# Altium project GARY_backplane.PrjPcb
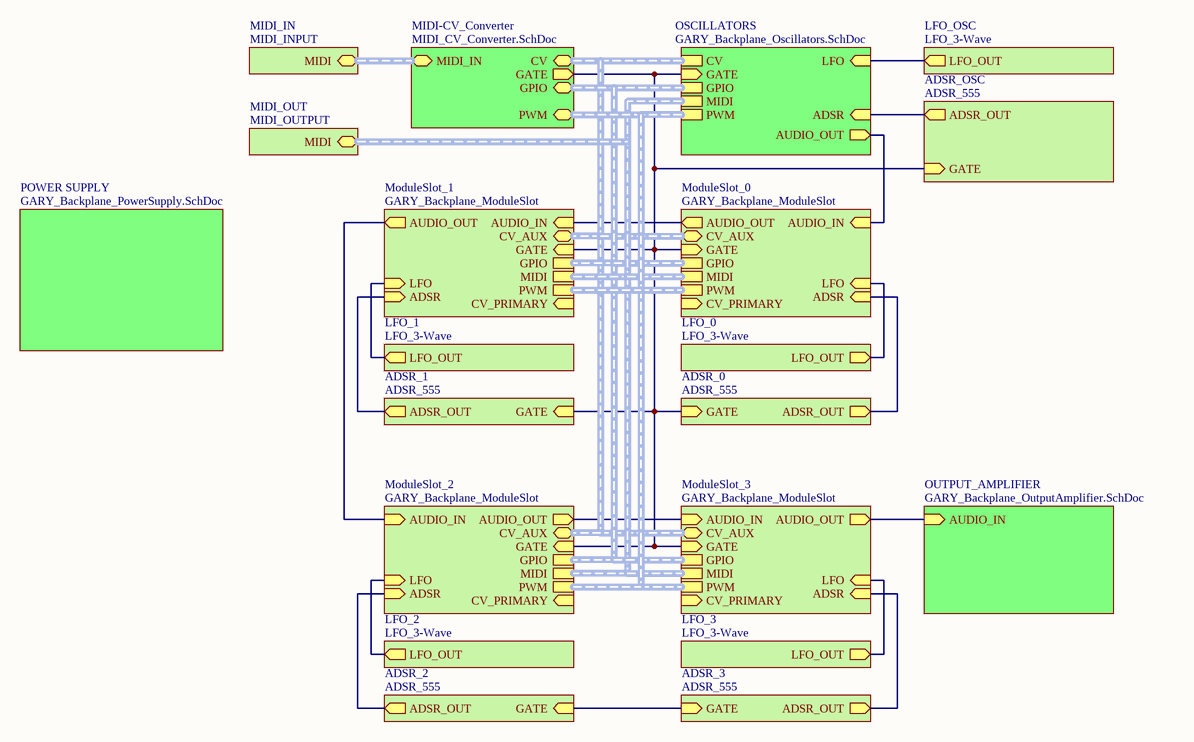
[diagram p0: backplane.SchDoc]
6 sheets, 8 parts. Net scope: hierarchical (ports join the sheet entries above them; power ports are global).
Board file: backplane.PcbDoc
Sheets:
  backplane.SchDoc
    MIDI-CV_Converter = MIDI_CV_Converter.SchDoc
    OSCILLATORS = GARY_Backplane_Oscillators.SchDoc
      SUMMING_AMPLIFIER = GARY_Backplane_OscillatorSummingAmplifier.SchDoc
    OUTPUT_AMPLIFIER = GARY_Backplane_OutputAmplifier.SchDoc
    POWER SUPPLY = GARY_Backplane_PowerSupply.SchDoc

## Sheet backplane.SchDoc: Backplane: Interconnect Diagram
size Letter; Engineer: Nicholas Morrow; DocumentNumber: 3; SheetNumber: 3; SheetTotal: 11; Project: GARY Synthesizer; ProjectName: GARY Synthesizer

### Sub-sheets
ADSR_0 = ADSR_555 (file not in this document): GATE (in), ADSR_OUT (out)
ADSR_1 = ADSR_555 (file not in this document): GATE (in), ADSR_OUT (out)
ADSR_2 = ADSR_555 (file not in this document): GATE (in), ADSR_OUT (out)
ADSR_3 = ADSR_555 (file not in this document): GATE (in), ADSR_OUT (out)
ADSR_OSC = ADSR_555 (file not in this document): GATE (in), ADSR_OUT (out)
LFO_0 = LFO_3-Wave (file not in this document): LFO_OUT (out)
LFO_1 = LFO_3-Wave (file not in this document): LFO_OUT (out)
LFO_2 = LFO_3-Wave (file not in this document): LFO_OUT (out)
LFO_3 = LFO_3-Wave (file not in this document): LFO_OUT (out)
LFO_OSC = LFO_3-Wave (file not in this document): LFO_OUT (out)
MIDI-CV_Converter = MIDI_CV_Converter.SchDoc: PWM (harness PWM), GPIO (harness GPIO), GATE (out), CV (harness CV_8_VOICE), MIDI_IN (harness MIDI)
MIDI_IN = MIDI_INPUT (file not in this document): MIDI (harness MIDI)
MIDI_OUT = MIDI_OUTPUT (file not in this document): MIDI (harness MIDI)
ModuleSlot_0 = GARY_Backplane_ModuleSlot (file not in this document): GPIO (harness GPIO), MIDI (harness MIDI), PWM (harness PWM), CV_AUX (harness CV_8_VOICE), GATE (in), AUDIO_IN (in), LFO (in), ADSR (in), AUDIO_OUT (out), CV_PRIMARY (in)
ModuleSlot_1 = GARY_Backplane_ModuleSlot (file not in this document): GPIO (harness GPIO), MIDI (harness MIDI), PWM (harness PWM), CV_AUX (harness CV_8_VOICE), GATE (in), AUDIO_IN (in), LFO (in), ADSR (in), AUDIO_OUT (out), CV_PRIMARY (in)
ModuleSlot_2 = GARY_Backplane_ModuleSlot (file not in this document): GPIO (harness GPIO), MIDI (harness MIDI), PWM (harness PWM), CV_AUX (harness CV_8_VOICE), GATE (in), AUDIO_IN (in), LFO (in), ADSR (in), AUDIO_OUT (out), CV_PRIMARY (in)
ModuleSlot_3 = GARY_Backplane_ModuleSlot (file not in this document): GPIO (harness GPIO), MIDI (harness MIDI), PWM (harness PWM), CV_AUX (harness CV_8_VOICE), GATE (in), AUDIO_IN (in), LFO (in), ADSR (in), AUDIO_OUT (out), CV_PRIMARY (in)
OSCILLATORS = GARY_Backplane_Oscillators.SchDoc: CV (harness CV_8_VOICE), GPIO (harness GPIO), GATE (in), MIDI (harness MIDI), PWM (harness PWM), AUDIO_OUT (out), LFO (in), ADSR (in)
OUTPUT_AMPLIFIER = GARY_Backplane_OutputAmplifier.SchDoc: AUDIO_IN (in)
POWER SUPPLY = GARY_Backplane_PowerSupply.SchDoc: no entries

### Nets
NetMCVC_CON_5: sheet ModuleSlot_0/GATE, sheet MIDI-CV_Converter/GATE, sheet ADSR_0/GATE, sheet OSCILLATORS/GATE, sheet ADSR_OSC/GATE, sheet ADSR_1/GATE, sheet ModuleSlot_1/GATE, sheet ModuleSlot_2/GATE, sheet ModuleSlot_3/GATE
(unnamed): sheet LFO_0/LFO_OUT, sheet ModuleSlot_0/LFO
(unnamed): sheet ModuleSlot_0/AUDIO_IN, sheet OSCILLATORS/AUDIO_OUT
(unnamed): sheet ModuleSlot_0/ADSR, sheet ADSR_0/ADSR_OUT
(unnamed): sheet ModuleSlot_0/AUDIO_OUT, sheet ModuleSlot_1/AUDIO_IN
(unnamed): sheet OSCILLATORS/LFO, sheet LFO_OSC/LFO_OUT
(unnamed): sheet OSCILLATORS/ADSR, sheet ADSR_OSC/ADSR_OUT
(unnamed): sheet OUTPUT_AMPLIFIER/AUDIO_IN, sheet ModuleSlot_3/AUDIO_OUT
(unnamed): sheet LFO_1/LFO_OUT, sheet ModuleSlot_1/LFO
(unnamed): sheet ADSR_1/ADSR_OUT, sheet ModuleSlot_1/ADSR
(unnamed): sheet LFO_2/LFO_OUT, sheet ModuleSlot_2/LFO
(unnamed): sheet ADSR_2/GATE, sheet ADSR_3/GATE
(unnamed): sheet ADSR_2/ADSR_OUT, sheet ModuleSlot_2/ADSR
(unnamed): sheet LFO_3/LFO_OUT, sheet ModuleSlot_3/LFO
(unnamed): sheet ADSR_3/ADSR_OUT, sheet ModuleSlot_3/ADSR
(unnamed): sheet ModuleSlot_1/AUDIO_OUT, sheet ModuleSlot_2/AUDIO_IN
(unnamed): sheet ModuleSlot_2/AUDIO_OUT, sheet ModuleSlot_3/AUDIO_IN

### Buses and harness runs
harness sheet MIDI-CV_Converter/CV = sheet ModuleSlot_0/CV_AUX = sheet ModuleSlot_1/CV_AUX = sheet ModuleSlot_2/CV_AUX = sheet ModuleSlot_3/CV_AUX = sheet OSCILLATORS/CV
harness sheet MIDI-CV_Converter/GPIO = sheet ModuleSlot_0/GPIO = sheet ModuleSlot_1/GPIO = sheet ModuleSlot_2/GPIO = sheet ModuleSlot_3/GPIO = sheet OSCILLATORS/GPIO
harness sheet MIDI-CV_Converter/MIDI_IN = sheet MIDI_IN/MIDI
harness sheet MIDI-CV_Converter/PWM = sheet ModuleSlot_0/PWM = sheet ModuleSlot_1/PWM = sheet ModuleSlot_2/PWM = sheet ModuleSlot_3/PWM = sheet OSCILLATORS/PWM
harness sheet MIDI_OUT/MIDI = sheet ModuleSlot_0/MIDI = sheet ModuleSlot_1/MIDI = sheet ModuleSlot_2/MIDI = sheet ModuleSlot_3/MIDI = sheet OSCILLATORS/MIDI

### Notes on the sheet
- Notes:
- Title:
- Size:
- Project:
- Letter
- Number:
- Revision:
- Date:
- Engineer:
- Sheet:
- of

## Sheet MIDI_CV_Converter.SchDoc: Backplane: MIDI-CV Converter Connector
size Letter; Engineer: Nicholas Morrow; Project: GARY Synthesizer
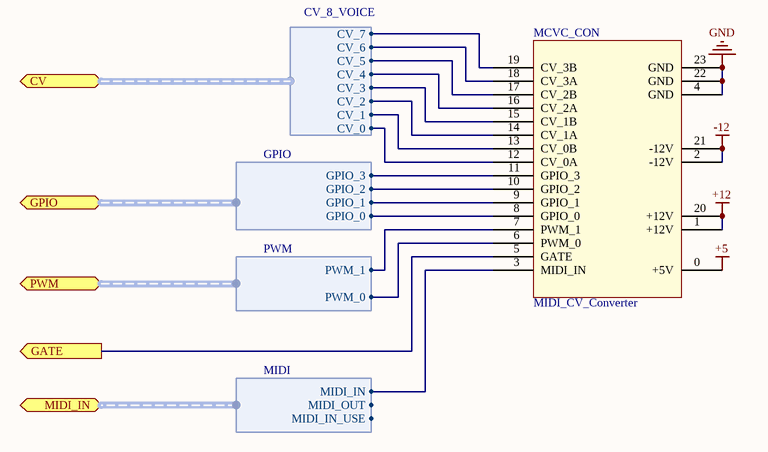
[diagram p1: MIDI_CV_Converter.SchDoc]

### Parts
MCVC_CON  MIDI_CV_Converter  [MIDI-CV CONVERTER SOCKET]

### Ports
CV (harness CV_8_VOICE), GATE (out), GPIO (harness GPIO), MIDI_IN (harness MIDI), PWM (harness PWM)

### Harnesses
CV_8_VOICE: CV_0, CV_2, CV_4, CV_6, CV_1, CV_3, CV_5, CV_7
MIDI: MIDI_IN, MIDI_OUT, MIDI_IN_USE
GPIO: GPIO_0, GPIO_1, GPIO_2, GPIO_3
PWM: PWM_0, PWM_1

### Nets
+5: MCVC_CON.0(+5V)  [project net +5V]
+12: MCVC_CON.1(+12V) MCVC_CON.20(+12V)  [project net +12V]
-12: MCVC_CON.2(-12V) MCVC_CON.21(-12V)  [project net -12V]
GND: MCVC_CON.4(GND) MCVC_CON.22(GND) MCVC_CON.23(GND)
NetMCVC_CON_3: MCVC_CON.3(MIDI_IN) ; port MIDI_IN.MIDI_IN
NetMCVC_CON_5: MCVC_CON.5(GATE) ; port GATE
NetMCVC_CON_6: MCVC_CON.6(PWM_0) ; port PWM.PWM_0
NetMCVC_CON_7: MCVC_CON.7(PWM_1) ; port PWM.PWM_1
NetMCVC_CON_8: MCVC_CON.8(GPIO_0) ; port GPIO.GPIO_0
NetMCVC_CON_9: MCVC_CON.9(GPIO_1) ; port GPIO.GPIO_1
NetMCVC_CON_10: MCVC_CON.10(GPIO_2) ; port GPIO.GPIO_2
NetMCVC_CON_11: MCVC_CON.11(GPIO_3) ; port GPIO.GPIO_3
NetMCVC_CON_12: MCVC_CON.12(CV_0A) ; port CV.CV_0
NetMCVC_CON_13: MCVC_CON.13(CV_0B) ; port CV.CV_1
NetMCVC_CON_14: MCVC_CON.14(CV_1A) ; port CV.CV_2
NetMCVC_CON_15: MCVC_CON.15(CV_1B) ; port CV.CV_3
NetMCVC_CON_16: MCVC_CON.16(CV_2A) ; port CV.CV_4
NetMCVC_CON_17: MCVC_CON.17(CV_2B) ; port CV.CV_5
NetMCVC_CON_18: MCVC_CON.18(CV_3A) ; port CV.CV_6
NetMCVC_CON_19: MCVC_CON.19(CV_3B) ; port CV.CV_7

### Notes on the sheet
- Notes:
- Title:
- Size:
- Project:
- Letter
- Number:
- Revision:
- Date:
- Engineer:
- Sheet:
- of

## Sheet GARY_Backplane_Oscillators.SchDoc: Backplane: Oscillator Section
size Letter; Engineer: Nicholas Morrow; Project: GARY Synthesizer
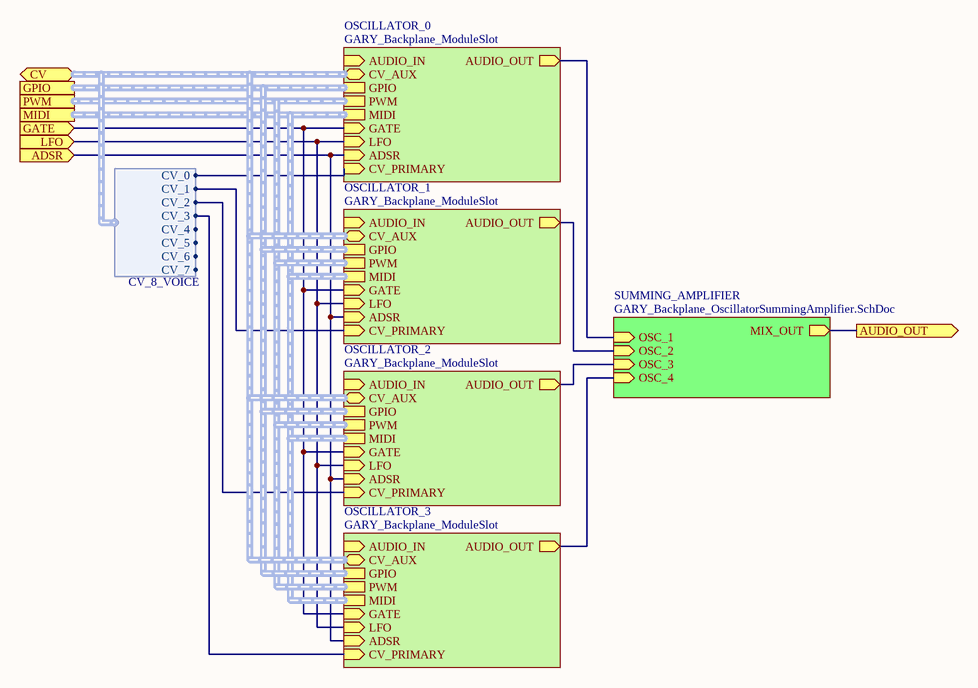
[diagram p2: GARY_Backplane_Oscillators.SchDoc]

### Sub-sheets
OSCILLATOR_0 = GARY_Backplane_ModuleSlot (file not in this document): GPIO (harness GPIO), MIDI (harness MIDI), PWM (harness PWM), LFO (in), ADSR (in), GATE (in), AUDIO_IN (in), AUDIO_OUT (out), CV_AUX (harness CV_8_VOICE), CV_PRIMARY (in)
OSCILLATOR_1 = GARY_Backplane_ModuleSlot (file not in this document): GPIO (harness GPIO), MIDI (harness MIDI), PWM (harness PWM), LFO (in), ADSR (in), GATE (in), AUDIO_IN (in), AUDIO_OUT (out), CV_AUX (harness CV_8_VOICE), CV_PRIMARY (in)
OSCILLATOR_2 = GARY_Backplane_ModuleSlot (file not in this document): GPIO (harness GPIO), MIDI (harness MIDI), PWM (harness PWM), LFO (in), ADSR (in), GATE (in), AUDIO_IN (in), AUDIO_OUT (out), CV_AUX (harness CV_8_VOICE), CV_PRIMARY (in)
OSCILLATOR_3 = GARY_Backplane_ModuleSlot (file not in this document): GPIO (harness GPIO), MIDI (harness MIDI), PWM (harness PWM), LFO (in), ADSR (in), GATE (in), AUDIO_IN (in), AUDIO_OUT (out), CV_AUX (harness CV_8_VOICE), CV_PRIMARY (in)
SUMMING_AMPLIFIER = GARY_Backplane_OscillatorSummingAmplifier.SchDoc: OSC_1 (in), OSC_2 (in), OSC_3 (in), OSC_4 (in), MIX_OUT (out)

### Ports
ADSR (in), AUDIO_OUT (out), CV (harness CV_8_VOICE), GATE (in), GPIO (harness GPIO), LFO (in), MIDI (harness MIDI), PWM (harness PWM)

### Harnesses
CV_8_VOICE: CV_0, CV_2, CV_4, CV_6, CV_1, CV_3, CV_5, CV_7

### Nets
NetMCVC_CON_5: port GATE, sheet OSCILLATOR_0/GATE, sheet OSCILLATOR_1/GATE, sheet OSCILLATOR_2/GATE, sheet OSCILLATOR_3/GATE
NetMCVC_CON_12: sheet OSCILLATOR_0/CV_PRIMARY, port CV.CV_0
NetMCVC_CON_13: sheet OSCILLATOR_1/CV_PRIMARY, port CV.CV_1
NetMCVC_CON_14: sheet OSCILLATOR_2/CV_PRIMARY, port CV.CV_2
NetMCVC_CON_15: sheet OSCILLATOR_3/CV_PRIMARY, port CV.CV_3
(unnamed): port AUDIO_OUT, sheet SUMMING_AMPLIFIER/MIX_OUT
(unnamed): port LFO, sheet OSCILLATOR_0/LFO, sheet OSCILLATOR_1/LFO, sheet OSCILLATOR_2/LFO, sheet OSCILLATOR_3/LFO
(unnamed): port ADSR, sheet OSCILLATOR_0/ADSR, sheet OSCILLATOR_1/ADSR, sheet OSCILLATOR_2/ADSR, sheet OSCILLATOR_3/ADSR
(unnamed): sheet SUMMING_AMPLIFIER/OSC_1, sheet OSCILLATOR_0/AUDIO_OUT
(unnamed): sheet SUMMING_AMPLIFIER/OSC_2, sheet OSCILLATOR_1/AUDIO_OUT
(unnamed): sheet SUMMING_AMPLIFIER/OSC_3, sheet OSCILLATOR_2/AUDIO_OUT
(unnamed): sheet SUMMING_AMPLIFIER/OSC_4, sheet OSCILLATOR_3/AUDIO_OUT

### Buses and harness runs
harness port CV = sheet OSCILLATOR_0/CV_AUX = sheet OSCILLATOR_1/CV_AUX = sheet OSCILLATOR_2/CV_AUX = sheet OSCILLATOR_3/CV_AUX
harness port GPIO = sheet OSCILLATOR_0/GPIO = sheet OSCILLATOR_1/GPIO = sheet OSCILLATOR_2/GPIO = sheet OSCILLATOR_3/GPIO
harness port MIDI = sheet OSCILLATOR_0/MIDI = sheet OSCILLATOR_1/MIDI = sheet OSCILLATOR_2/MIDI = sheet OSCILLATOR_3/MIDI
harness port PWM = sheet OSCILLATOR_0/PWM = sheet OSCILLATOR_1/PWM = sheet OSCILLATOR_2/PWM = sheet OSCILLATOR_3/PWM

### Notes on the sheet
- Notes:
- Title:
- Size:
- Project:
- Letter
- Number:
- Revision:
- Date:
- Engineer:
- Sheet:
- of

## Sheet GARY_Backplane_OscillatorSummingAmplifier.SchDoc: Backplane: Oscillator Summing Amplifier
size Letter; Engineer: Nicholas Morrow; Project: GARY Synthesizer
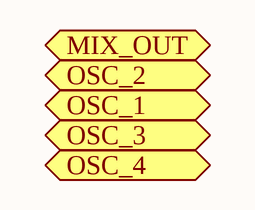
[diagram p3: GARY_Backplane_OscillatorSummingAmplifier.SchDoc]

### Ports
MIX_OUT, OSC_1, OSC_2, OSC_3, OSC_4

### Notes on the sheet
- Notes:
- Title:
- Size:
- Project:
- Letter
- Number:
- Revision:
- Date:
- Engineer:
- Sheet:
- of

## Sheet GARY_Backplane_OutputAmplifier.SchDoc: Backplane: Output Amplifier
size Letter; Engineer: Nicholas Morrow; Project: GARY Synthesizer
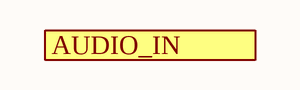
[diagram p4: GARY_Backplane_OutputAmplifier.SchDoc]

### Ports
AUDIO_IN

### Notes on the sheet
- Notes:
- Title:
- Size:
- Project:
- Letter
- Number:
- Revision:
- Date:
- Engineer:
- Sheet:
- of

## Sheet GARY_Backplane_PowerSupply.SchDoc: Backplane: Power Supply
size Letter; Engineer: Nicholas Morrow; DocumentNumber: 4; SheetNumber: 4; SheetTotal: 11; Project: GARY Synthesizer
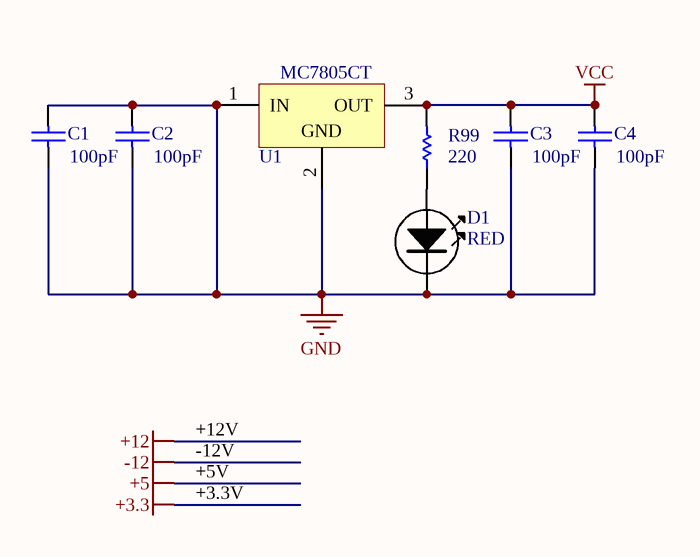
[diagram p5: GARY_Backplane_PowerSupply.SchDoc]

### Parts
C1  value 100pF  [RAD-0.3]  (hidden comment: Cap)
C2  value 100pF  [RAD-0.3]  (hidden comment: Cap)
C3  value 100pF  [RAD-0.3]  (hidden comment: Cap)
C4  value 100pF  [RAD-0.3]  (hidden comment: Cap)
D1  RED  [LED-5MM-RED]
R99  value 220  [AXIAL-0.3]
U1  MC7805CT  [221A-06]

### Nets
GND: C1.1 C1.2 C2.1 C2.2 C3.1 C4.1 D1.K U1.1(IN) U1.2(GND)
VCC: C3.2 C4.2 R99.2 U1.3(OUT)
NetD1_A: D1.A R99.1

### Notes on the sheet
- Notes:
- Title:
- Size:
- Project:
- Letter
- Number:
- Revision:
- Date:
- Engineer:
- Sheet:
- of

### Library data of the parts
C1-C4 = Cap: Capacitor; Published: 8-Jun-2000; LatestRevisionDate: 17-Jul-2002; LatestRevisionNote: Re-released for DXP Platform.; PackageReference: RAD-0.3; Publisher: Altium Limited; PackageDescription: Radial Cap, Thru-Hole; 2 Leads; 0.3 in Pin Spacing
D1 = LED-RED-5MM
R99 = Res1: Resistor; Published: 8-Jun-2000; LatestRevisionDate: 17-Jul-2002; LatestRevisionNote: Re-released for DXP Platform.; PackageReference: AXIAL-0.3; Publisher: Altium Limited; PackageDescription: Axial Device, Thru-Hole; 2 Leads; 0.3 in Pin Spacing
U1 = MC7805CT: Three-Terminal Positive Voltage Regulator; Note: Heatsink surface is connected to Pin 2; Published: 15-Apr-2002; DatasheetVersion: 1997; PackageVersion: 1997; PackageReference: 221A-06; Publisher: Altium Limited; PackageDescription: TO, Thru-Hole, Vertical, Heatsink Mounted; 3 In-Line Leads; Pitch 2.54 mm; Code_JEDEC: TO-262-AA; ComponentLink1Description: Manufacturer Link; ComponentLink1URL: http://www.onsemi.com/site/products/taxonomy/0,4438,503,00.html; ComponentLink2Description: Datasheet; ComponentLink2URL: http://www.onsemi.com/pub/Collateral/MC7800-D.PDF

## Nets that join several sheets
GND: MIDI_CV_Converter (MCVC_CON.4 MCVC_CON.22 MCVC_CON.23), GARY_Backplane_PowerSupply (9 pins)